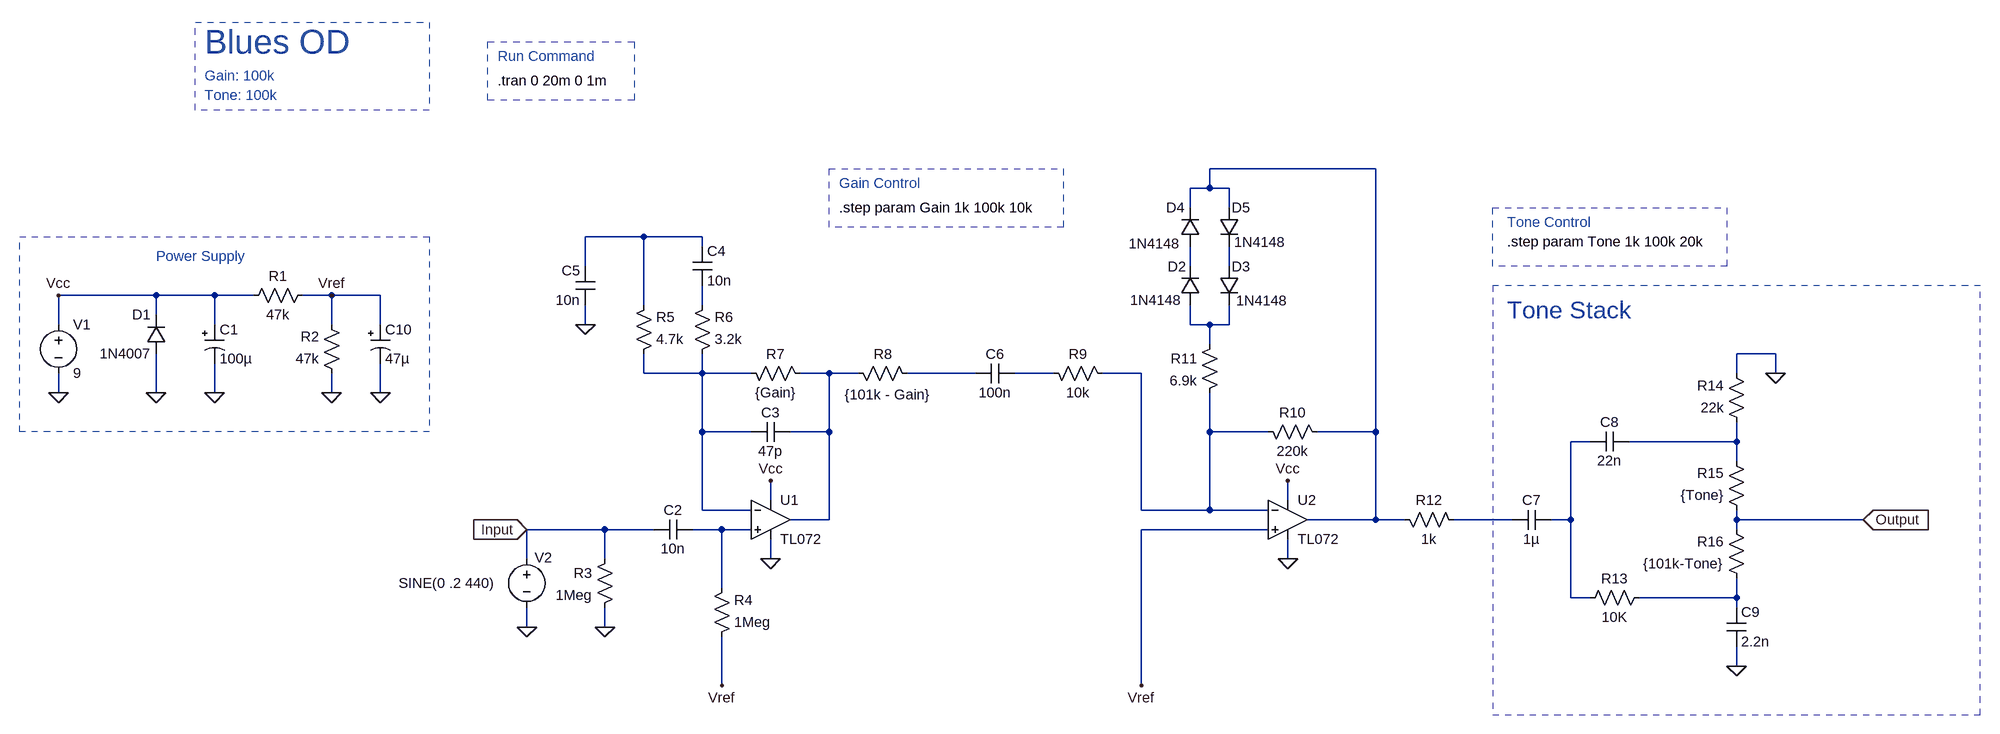
[diagram p0: schematic blues-od.asc]
blues-od.asc, the LTspice schematic file:
Version 4
SHEET 1 3056 1016
WIRE 1760 32 1488 32
WIRE 1488 64 1488 32
WIRE 1488 64 1456 64
WIRE 1520 64 1488 64
WIRE 1456 96 1456 64
WIRE 1520 96 1520 64
WIRE 560 144 464 144
WIRE 656 144 560 144
WIRE 656 160 656 144
WIRE 464 192 464 144
WIRE 1456 192 1456 160
WIRE 1520 192 1520 160
WIRE -240 240 -400 240
WIRE -144 240 -240 240
WIRE -80 240 -144 240
WIRE 48 240 0 240
WIRE 128 240 48 240
WIRE 560 256 560 144
WIRE 656 256 656 224
WIRE -240 272 -240 240
WIRE -400 288 -400 240
WIRE -144 288 -144 240
WIRE 48 288 48 240
WIRE 128 288 128 240
WIRE 464 288 464 256
WIRE 1456 288 1456 256
WIRE 1488 288 1456 288
WIRE 1520 288 1520 256
WIRE 1520 288 1488 288
WIRE 1488 320 1488 288
WIRE 2416 336 2352 336
WIRE 560 368 560 336
WIRE 656 368 656 336
WIRE 656 368 560 368
WIRE 736 368 656 368
WIRE 864 368 816 368
WIRE 912 368 864 368
WIRE 1104 368 992 368
WIRE 1232 368 1168 368
WIRE 1376 368 1312 368
WIRE 2352 368 2352 336
WIRE 2416 368 2416 336
WIRE -400 400 -400 368
WIRE -240 400 -240 336
WIRE -144 400 -144 352
WIRE 48 400 48 368
WIRE 128 400 128 352
WIRE 656 464 656 368
WIRE 736 464 656 464
WIRE 864 464 864 368
WIRE 864 464 800 464
WIRE 1488 464 1488 400
WIRE 1584 464 1488 464
WIRE 1760 464 1760 32
WIRE 1760 464 1664 464
WIRE 2112 480 2080 480
WIRE 2352 480 2352 448
WIRE 2352 480 2176 480
WIRE 2352 512 2352 480
WIRE 768 576 768 544
WIRE 1616 576 1616 544
WIRE 656 592 656 464
WIRE 736 592 656 592
WIRE 1376 592 1376 368
WIRE 1488 592 1488 464
WIRE 1488 592 1376 592
WIRE 1584 592 1488 592
WIRE 864 608 864 464
WIRE 864 608 800 608
WIRE 1760 608 1760 464
WIRE 1760 608 1648 608
WIRE 1808 608 1760 608
WIRE 1984 608 1888 608
WIRE 2080 608 2080 480
WIRE 2080 608 2048 608
WIRE 2352 608 2352 592
WIRE 2560 608 2352 608
WIRE 496 624 368 624
WIRE 576 624 496 624
WIRE 688 624 640 624
WIRE 736 624 688 624
WIRE 1584 624 1376 624
WIRE 2352 624 2352 608
WIRE 368 672 368 624
WIRE 496 672 496 624
WIRE 768 672 768 640
WIRE 1616 672 1616 640
WIRE 688 720 688 624
WIRE 2080 736 2080 608
WIRE 2112 736 2080 736
WIRE 2352 736 2352 704
WIRE 2352 736 2192 736
WIRE 2352 752 2352 736
WIRE 368 784 368 752
WIRE 496 784 496 752
WIRE 2352 848 2352 816
WIRE 688 880 688 800
WIRE 1376 880 1376 624
FLAG -400 400 0
FLAG 48 400 0
FLAG 128 400 0
FLAG -400 240 Vcc
FLAG 48 240 Vref
FLAG 496 784 0
FLAG 368 784 0
FLAG 768 672 0
FLAG 1616 672 0
FLAG 768 544 Vcc
FLAG 1616 544 Vcc
FLAG 464 288 0
FLAG 2416 368 0
FLAG 2352 848 0
FLAG 368 624 Input
IOPIN 368 624 In
FLAG 2560 608 Output
IOPIN 2560 608 In
FLAG 688 880 Vref
FLAG 1376 880 Vref
FLAG -240 400 0
FLAG -144 400 0
SYMBOL voltage -400 272 R0
WINDOW 123 0 0 Left 0
WINDOW 39 0 0 Left 0
SYMATTR InstName V1
SYMATTR Value 9
SYMBOL voltage 368 656 M0
WINDOW 0 -42 14 Left 2
WINDOW 3 50 56 Left 2
WINDOW 123 0 0 Left 0
WINDOW 39 0 0 Left 0
SYMATTR InstName V2
SYMATTR Value SINE(0 .2 440)
SYMBOL diode -224 336 R180
WINDOW 0 24 64 Left 2
WINDOW 3 24 0 Left 2
SYMATTR InstName D1
SYMATTR Value 1N4007
SYMBOL res 16 224 R90
WINDOW 0 0 56 VBottom 2
WINDOW 3 32 56 VTop 2
SYMATTR InstName R1
SYMATTR Value 47k
SYMBOL res 64 384 R180
WINDOW 0 36 76 Left 2
WINDOW 3 36 40 Left 2
SYMATTR InstName R2
SYMATTR Value 47k
SYMBOL OpAmps\\TL072 768 544 R0
SYMATTR InstName U1
SYMBOL OpAmps\\TL072 1616 544 R0
SYMATTR InstName U2
SYMBOL res 512 656 M0
SYMATTR InstName R3
SYMATTR Value 1Meg
SYMBOL cap 640 640 M270
WINDOW 0 32 32 VTop 2
WINDOW 3 0 32 VBottom 2
SYMATTR InstName C2
SYMATTR Value 10n
SYMBOL res 672 816 M180
WINDOW 0 36 76 Left 2
WINDOW 3 36 40 Left 2
SYMATTR InstName R4
SYMATTR Value 1Meg
SYMBOL cap 800 480 M270
WINDOW 0 32 32 VTop 2
WINDOW 3 0 32 VBottom 2
SYMATTR InstName C3
SYMATTR Value 47p
SYMBOL res 544 352 M180
WINDOW 0 36 76 Left 2
WINDOW 3 36 40 Left 2
SYMATTR InstName R5
SYMATTR Value 4.7k
SYMBOL res 640 352 M180
WINDOW 0 36 76 Left 2
WINDOW 3 36 40 Left 2
SYMATTR InstName R6
SYMATTR Value 3.2k
SYMBOL cap 640 224 M180
WINDOW 0 24 56 Left 2
WINDOW 3 24 8 Left 2
SYMATTR InstName C4
SYMATTR Value 10n
SYMBOL cap 480 192 M0
SYMATTR InstName C5
SYMATTR Value 10n
SYMBOL res 832 384 M270
WINDOW 0 32 56 VTop 2
WINDOW 3 0 56 VBottom 2
SYMATTR InstName R7
SYMATTR Value {Gain}
SYMBOL res 1008 384 M270
WINDOW 0 32 56 VTop 2
WINDOW 3 -3 48 VBottom 2
SYMATTR InstName R8
SYMATTR Value {101k - Gain}
SYMBOL cap 1168 384 M270
WINDOW 0 32 32 VTop 2
WINDOW 3 0 32 VBottom 2
SYMATTR InstName C6
SYMATTR Value 100n
SYMBOL res 1328 384 M270
WINDOW 0 32 56 VTop 2
WINDOW 3 0 56 VBottom 2
SYMATTR InstName R9
SYMATTR Value 10k
SYMBOL res 1680 480 M270
WINDOW 0 32 56 VTop 2
WINDOW 3 0 56 VBottom 2
SYMATTR InstName R10
SYMATTR Value 220k
SYMBOL res 1504 304 M0
SYMATTR InstName R11
SYMATTR Value 6.9k
SYMBOL diode 1440 256 M180
WINDOW 0 -21 63 Left 2
WINDOW 3 -82 8 Left 2
SYMATTR InstName D2
SYMATTR Value 1N4148
SYMBOL diode 1536 192 M0
WINDOW 0 -19 1 Left 2
WINDOW 3 -80 57 Left 2
SYMATTR InstName D3
SYMATTR Value 1N4148
SYMBOL diode 1440 160 M180
WINDOW 0 -23 64 Left 2
WINDOW 3 -85 5 Left 2
SYMATTR InstName D4
SYMATTR Value 1N4148
SYMBOL diode 1536 96 M0
WINDOW 0 -19 0 Left 2
WINDOW 3 -77 57 Left 2
SYMATTR InstName D5
SYMATTR Value 1N4148
SYMBOL res 1904 624 M270
WINDOW 0 32 56 VTop 2
WINDOW 3 0 56 VBottom 2
SYMATTR InstName R12
SYMATTR Value 1k
SYMBOL cap 2048 592 R90
WINDOW 0 0 32 VBottom 2
WINDOW 3 32 32 VTop 2
SYMATTR InstName C7
SYMATTR Value 1µ
SYMBOL cap 2176 464 R90
WINDOW 0 0 32 VBottom 2
WINDOW 3 32 32 VTop 2
SYMATTR InstName C8
SYMATTR Value 22n
SYMBOL res 2208 720 R90
WINDOW 0 0 56 VBottom 2
WINDOW 3 32 56 VTop 2
SYMATTR InstName R13
SYMATTR Value 10K
SYMBOL res 2368 464 R180
WINDOW 0 36 76 Left 2
WINDOW 3 36 40 Left 2
SYMATTR InstName R14
SYMATTR Value 22k
SYMBOL res 2368 608 R180
WINDOW 0 36 76 Left 2
WINDOW 3 36 40 Left 2
SYMATTR InstName R15
SYMATTR Value {Tone}
SYMBOL res 2368 720 R180
WINDOW 0 36 76 Left 2
WINDOW 3 36 40 Left 2
SYMATTR InstName R16
SYMATTR Value {101k-Tone}
SYMBOL cap 2336 752 R0
SYMATTR InstName C9
SYMATTR Value 2.2n
SYMBOL polcap -160 288 R0
SYMATTR InstName C1
SYMATTR Value 100µ
SYMBOL polcap 112 288 R0
SYMATTR InstName C10
SYMATTR Value 47µ
TEXT 320 -112 Left 2 !.tran 0 20m 0 1m
TEXT 880 96 Left 2 !.step param Gain 1k 100k 10k
TEXT 1976 152 Left 2 !.step param Tone 1k 100k 20k
TEXT 1976 264 Left 4 ;Tone Stack
TEXT -240 176 Left 2 ;Power Supply
TEXT -160 -176 Left 5 ;Blues OD
TEXT -160 -120 Left 2 ;Gain: 100k
TEXT -160 -88 Left 2 ;Tone: 100k
TEXT 320 -152 Left 2 ;Run Command
TEXT 880 56 Left 2 ;Gain Control
TEXT 1976 120 Left 2 ;Tone Control
LINE Normal 2752 224 1952 224 1
LINE Normal 2752 928 2752 224 1
LINE Normal 1952 928 2752 928 1
LINE Normal 1952 224 1952 928 1
RECTANGLE Normal 208 464 -464 144 1
RECTANGLE Normal 208 -64 -176 -208 1
RECTANGLE Normal 544 -80 304 -176 1
RECTANGLE Normal 1248 128 864 32 1
RECTANGLE Normal 2336 192 1952 96 1

The netlist it stands for:
* blues-od.asc
V1 Vcc 0 9
V2 Input 0 SINE(0 .2 440)
D1 0 Vcc 1N4007
R1 Vref Vcc 47k
R2 0 Vref 47k
XU1 N015 N007 Vcc 0 N008 TL072  ; pins In+ In- V+ V- OUT
XU2 Vref N011 Vcc 0 N001 TL072  ; pins In+ In- V+ V- OUT
R3 Input 0 1Meg
C2 N015 Input 10n
R4 Vref N015 1Meg
C3 N008 N007 47p
R5 N007 N002 4.7k
R6 N007 N005 3.2k
C4 N005 N002 10n
C5 N002 0 10n
R7 N008 N007 {Gain}
R8 N009 N008 {101k - Gain}
C6 N010 N009 100n
R9 N011 N010 10k
R10 N001 N011 220k
R11 N006 N011 6.9k
D2 N006 N003 1N4148
D3 N004 N006 1N4148
D4 N003 N001 1N4148
D5 N001 N004 1N4148
R12 N014 N001 1k
C7 N012 N014 1µ
C8 N013 N012 22n
R13 N016 N012 10K
R14 N013 0 22k
R15 Output N013 {Tone}
R16 N016 Output {101k-Tone}
C9 N016 0 2.2n
C1 Vcc 0 100µ
C10 Vref 0 47µ
.model D D
.lib standard.dio
.tran 0 20m 0 1m
.step param Gain 1k 100k 10k
.step param Tone 1k 100k 20k
* Tone Stack
* Power Supply
* Blues OD
* Gain: 100k
* Tone: 100k
* Run Command
* Gain Control
* Tone Control
.backanno
.end